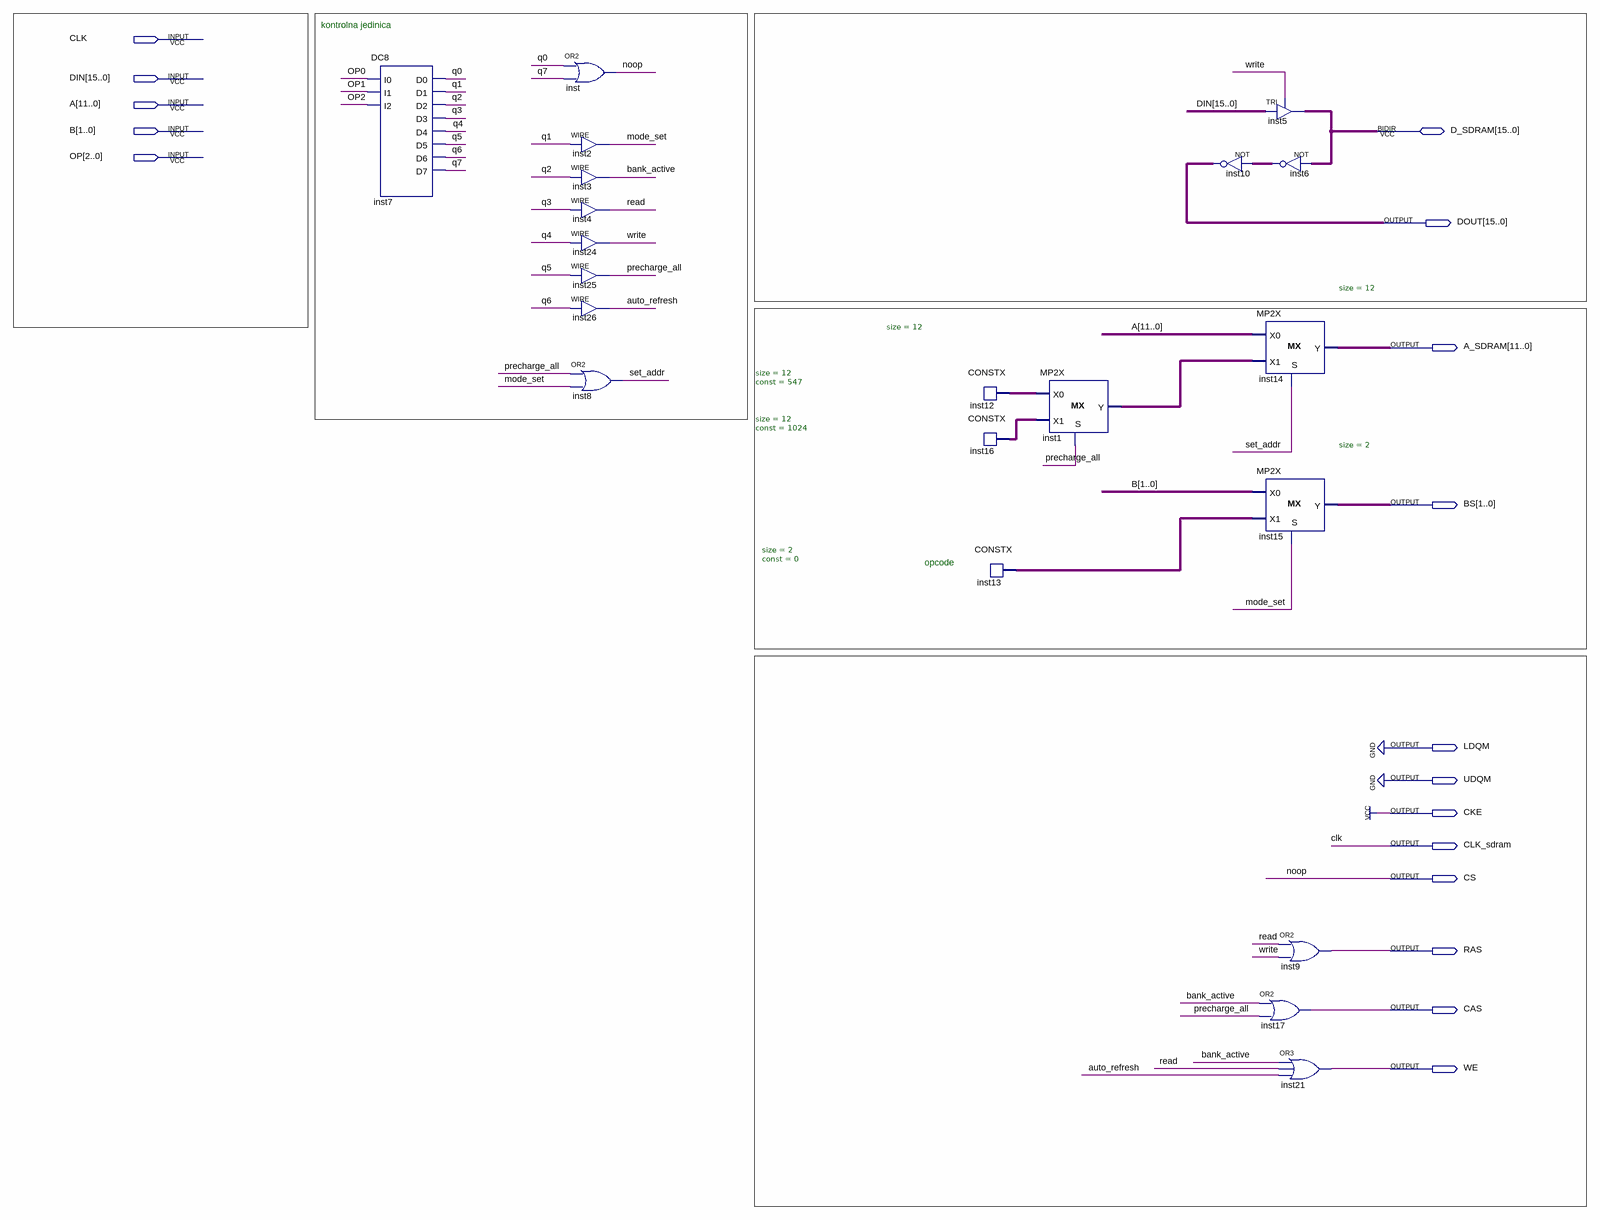
[diagram p0: schematic sheet]
// Quartus schematic sdram_controller.bdf as structural Verilog: 21 symbols, 17 pins
module sdram_controller (
  input  CLK,
  input  [15:0] DIN,
  input  [11:0] A,
  input  [1:0] B,
  input  [2:0] OP,
  inout  [15:0] D_SDRAM,
  output [15:0] DOUT,
  output [11:0] A_SDRAM,
  output [1:0] BS,
  output LDQM,
  output UDQM,
  output CKE,
  output CLK_sdram,
  output CS,
  output RAS,
  output CAS,
  output WE
);

  wire auto_refresh, bank_active, mode_set, precharge_all, q0, q1, q2, q3, q4, q5, q6, q7, read, set_addr,
       write;
  wire [1:0] inst13_data;
  wire [11:0] inst1_y, inst12_data, inst16_data;
  wire [15:0] inst6_out;

  DC8 inst7 (
    .I0(OP[0]), .I1(OP[1]), .I2(OP[2]), .D0(q0), .D1(q1), .D2(q2), .D3(q3), .D4(q4), .D5(q5), .D6(q6), .D7(q7));
  or inst (CS, q0, q7);
  assign mode_set = q1;  // WIRE inst2
  assign bank_active = q2;  // WIRE inst3
  assign read = q3;  // WIRE inst4
  assign write = q4;  // WIRE inst24
  assign precharge_all = q5;  // WIRE inst25
  assign auto_refresh = q6;  // WIRE inst26
  or inst8 (set_addr, precharge_all, mode_set);
  CONSTX #(.size(12), .\const (547)) inst12 (.data(inst12_data));
  CONSTX #(.size(12), .\const (1024)) inst16 (.data(inst16_data));
  CONSTX #(.size(2), .\const (0)) inst13 (.data(inst13_data));
  MP2X #(.size(12)) inst1 (.S(precharge_all), .X0(inst12_data), .X1(inst16_data), .Y(inst1_y));
  assign DOUT = ~inst6_out;  // NOT inst10, 16 bits wide
  TRI inst5[15:0] (.IN(DIN), .OE(write), .OUT(D_SDRAM));
  assign inst6_out = ~D_SDRAM;  // NOT inst6, 16 bits wide
  MP2X #(.size(12)) inst14 (.S(set_addr), .X0(A), .X1(inst1_y), .Y(A_SDRAM));
  MP2X #(.size(2)) inst15 (.S(mode_set), .X0(B), .X1(inst13_data), .Y(BS));
  or inst17 (CAS, bank_active, precharge_all);
  or inst9 (RAS, read, write);
  or inst21 (WE, bank_active, read, auto_refresh);

  assign CKE = 1'b1;
  assign CLK_sdram = CLK;
  assign LDQM = 1'b0;
  assign UDQM = 1'b0;

  // Other names for the same wires on the sheet: noop = CS

  // Notes on the sheet:
  //   kontrolna jedinica
  //   opcode
endmodule
